# EAGLE design lcd-breakoutboard (EAGLE 6.2)
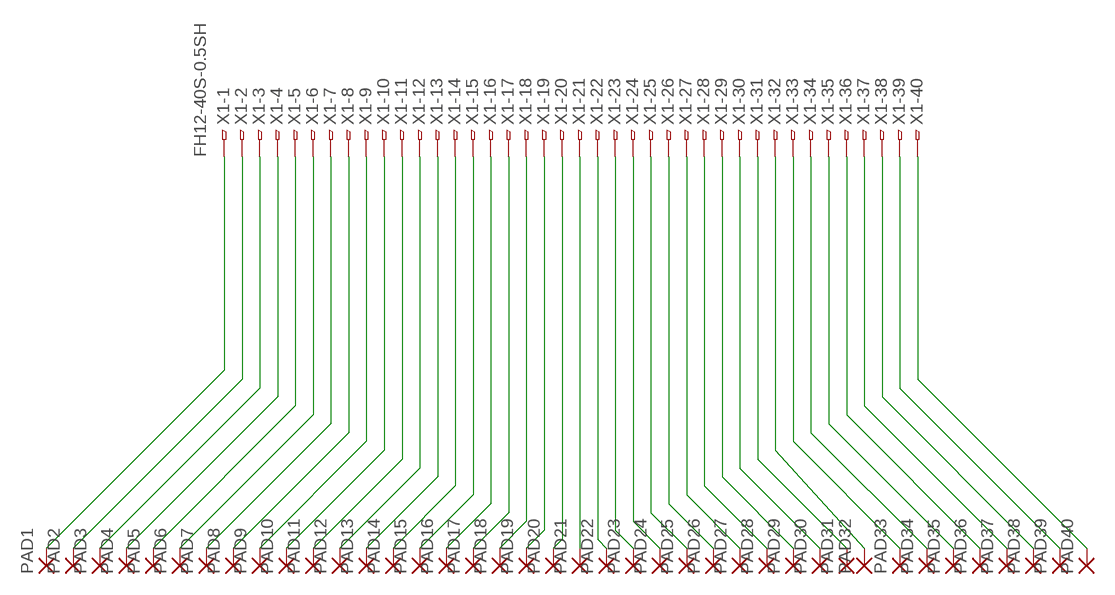
[diagram p0: schematic, sheet 1]

## Parts
PAD1  2,15/1,0  [2,15/1,0]
PAD2  2,15/1,0  [2,15/1,0]
PAD3  2,15/1,0  [2,15/1,0]
PAD4  2,15/1,0  [2,15/1,0]
PAD5  2,15/1,0  [2,15/1,0]
PAD6  2,15/1,0  [2,15/1,0]
PAD7  2,15/1,0  [2,15/1,0]
PAD8  2,15/1,0  [2,15/1,0]
PAD9  2,15/1,0  [2,15/1,0]
PAD10  2,15/1,0  [2,15/1,0]
PAD11  2,15/1,0  [2,15/1,0]
PAD12  2,15/1,0  [2,15/1,0]
PAD13  2,15/1,0  [2,15/1,0]
PAD14  2,15/1,0  [2,15/1,0]
PAD15  2,15/1,0  [2,15/1,0]
PAD16  2,15/1,0  [2,15/1,0]
PAD17  2,15/1,0  [2,15/1,0]
PAD18  2,15/1,0  [2,15/1,0]
PAD19  2,15/1,0  [2,15/1,0]
PAD20  2,15/1,0  [2,15/1,0]
PAD21  2,15/1,0  [2,15/1,0]
PAD22  2,15/1,0  [2,15/1,0]
PAD23  2,15/1,0  [2,15/1,0]
PAD24  2,15/1,0  [2,15/1,0]
PAD25  2,15/1,0  [2,15/1,0]
PAD26  2,15/1,0  [2,15/1,0]
PAD27  2,15/1,0  [2,15/1,0]
PAD28  2,15/1,0  [2,15/1,0]
PAD29  2,15/1,0  [2,15/1,0]
PAD30  2,15/1,0  [2,15/1,0]
PAD31  2,15/1,0  [2,15/1,0]
PAD32  2,15/1,0  [2,15/1,0]
PAD33  2,15/1,0  [2,15/1,0]
PAD34  2,15/1,0  [2,15/1,0]
PAD35  2,15/1,0  [2,15/1,0]
PAD36  2,15/1,0  [2,15/1,0]
PAD37  2,15/1,0  [2,15/1,0]
PAD38  2,15/1,0  [2,15/1,0]
PAD39  2,15/1,0  [2,15/1,0]
PAD40  2,15/1,0  [2,15/1,0]
X1  FH12-40S-0.5SH  [FH12-40S-0.5SH]

## Nets
N$1: PAD1.1(P) X1.1
N$2: PAD2.1(P) X1.2
N$3: PAD3.1(P) X1.3
N$4: PAD4.1(P) X1.4
N$5: PAD5.1(P) X1.5
N$6: PAD6.1(P) X1.6
N$7: PAD7.1(P) X1.7
N$8: PAD8.1(P) X1.8
N$9: PAD9.1(P) X1.9
N$10: PAD10.1(P) X1.10
N$11: PAD11.1(P) X1.11
N$12: PAD12.1(P) X1.12
N$13: PAD13.1(P) X1.13
N$14: PAD14.1(P) X1.14
N$15: PAD15.1(P) X1.15
N$16: PAD16.1(P) X1.16
N$17: PAD17.1(P) X1.17
N$18: PAD18.1(P) X1.18
N$19: PAD19.1(P) X1.19
N$20: PAD20.1(P) X1.20
N$21: PAD21.1(P) X1.21
N$22: PAD22.1(P) X1.22
N$23: PAD23.1(P) X1.23
N$24: PAD24.1(P) X1.24
N$25: PAD25.1(P) X1.25
N$26: PAD26.1(P) X1.26
N$27: PAD27.1(P) X1.27
N$28: PAD28.1(P) X1.28
N$29: PAD29.1(P) X1.29
N$30: PAD30.1(P) X1.30
N$31: PAD31.1(P) X1.31
N$32: PAD32.1(P) X1.32
N$33: PAD33.1(P) X1.33
N$34: PAD34.1(P) X1.34
N$35: PAD35.1(P) X1.35
N$36: PAD36.1(P) X1.36
N$37: PAD37.1(P) X1.37
N$38: PAD38.1(P) X1.38
N$39: PAD39.1(P) X1.39
N$40: PAD40.1(P) X1.40

## Library data of the parts
PAD1-PAD40 = wirepad:2,15/1,0: THROUGH-HOLE PAD
X1 = con-hirose:FH12-40S-0.5S: 0.5mm Pitch Connectors For FPC/FFC Source: Data sheet <http://www.hirose.co.jp/cataloge_hp/e58605370.pdf>; MPN: FH12-40S-0.5SH(55); OC_FARNELL: 1324556; OC_NEWARK: 34M6178

## Board
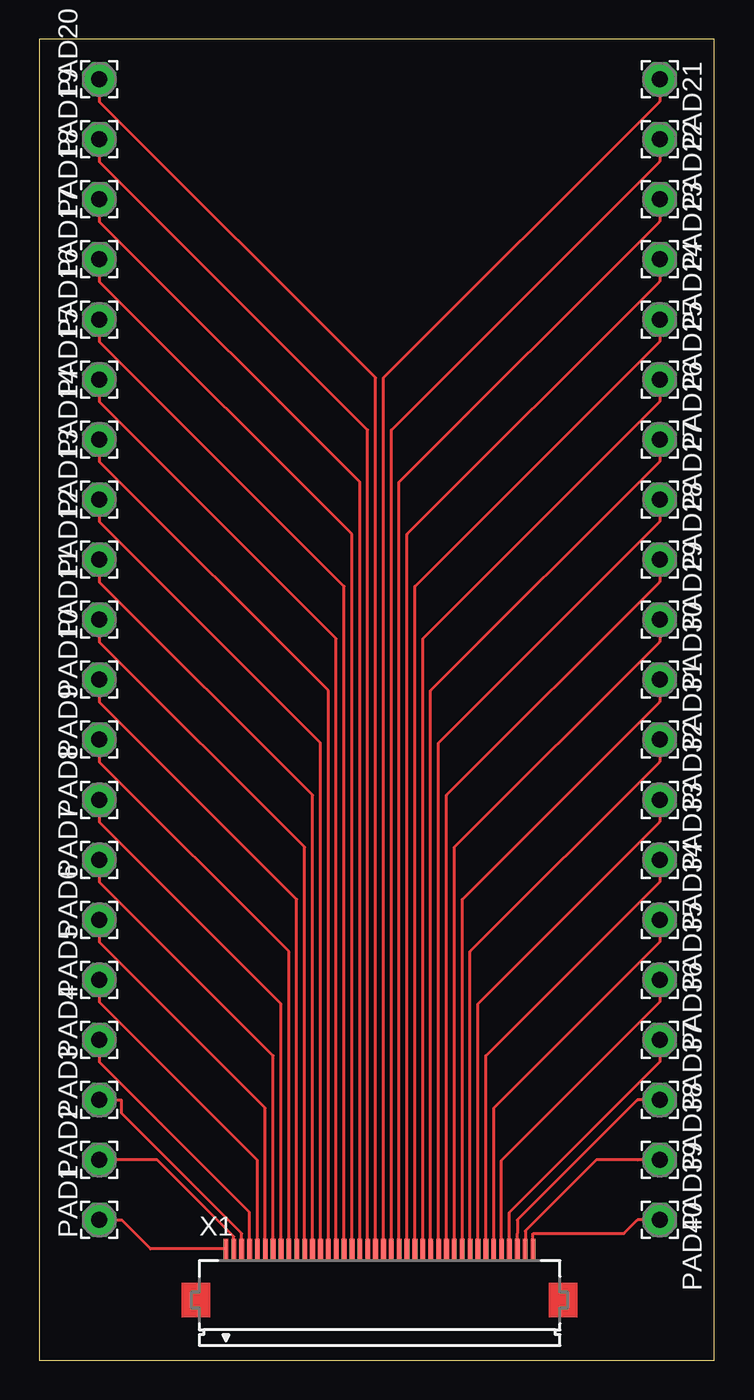
[diagram p1: board, top side]

Size 42.85 x 83.81 mm. Coordinates in mm from the lower left corner, seen from the top.
Outline: 0,0 42.85,0 42.85,83.81 0,83.81 0,0
Copper layers (1*16): Top 0.035mm / dielectric 1.5mm / Bottom 0.035mm
Design rules: minimum track width 8mil, minimum drill 0.3mm, track to track 9mil, track to pad 9mil, pad to pad 9mil, via to via 9mil, smd to smd 9mil, copper to edge 40mil, drill to drill 4mil, minimum pad ring 10mil, minimum via ring 8mil, stop-mask expansion 4mil, vias tented up to drill 0mil, thermal gap 10mil

### Footprints (pad centres in the part's own frame; a part is rotated, then mirrored left to right if it is on the bottom)
2,15/1,0 = drill 1.016 pad 2.159 octagon: 1 0,0
FH12-40S-0.5SH = smd 0.3 x 1.3: 1 -9.75,3.25; 2 -9.25,3.25; 3 -8.75,3.25; 4 -8.25,3.25; 5 -7.75,3.25; 6 -7.25,3.25; 7 -6.75,3.25; 8 -6.25,3.25; 9 -5.75,3.25; 10 -5.25,3.25; 11 -4.75,3.25; 12 -4.25,3.25; 13 -3.75,3.25; 14 -3.25,3.25; 15 -2.75,3.25; 16 -2.25,3.25; 17 -1.75,3.25; 18 -1.25,3.25; 19 -0.75,3.25; 20 -0.25,3.25; 21 0.25,3.25; 22 0.75,3.25; 23 1.25,3.25; 24 1.75,3.25; 25 2.25,3.25; 26 2.75,3.25; 27 3.25,3.25; 28 3.75,3.25; 29 4.25,3.25; 30 4.75,3.25; 31 5.25,3.25; 32 5.75,3.25; 33 6.25,3.25; 34 6.75,3.25; 35 7.25,3.25; 36 7.75,3.25; 37 8.25,3.25; 38 8.75,3.25; 39 9.25,3.25; 40 9.75,3.25

### Placement (x,y rotation side)
PAD1  3.81,8.89 90 top
PAD2  3.81,12.7 90 top
PAD3  3.81,16.51 90 top
PAD4  3.81,20.32 90 top
PAD5  3.81,24.13 90 top
PAD6  3.81,27.94 90 top
PAD7  3.81,31.75 90 top
PAD8  3.81,35.56 90 top
PAD9  3.81,39.37 90 top
PAD10  3.81,43.18 90 top
PAD11  3.81,46.99 90 top
PAD12  3.81,50.8 90 top
PAD13  3.81,54.61 90 top
PAD14  3.81,58.42 90 top
PAD15  3.81,62.23 90 top
PAD16  3.81,66.04 90 top
PAD17  3.81,69.85 90 top
PAD18  3.81,73.66 90 top
PAD19  3.81,77.47 90 top
PAD20  3.81,81.28 90 top
PAD21  39.37,81.28 270 top
PAD22  39.37,77.47 270 top
PAD23  39.37,73.66 270 top
PAD24  39.37,69.85 270 top
PAD25  39.37,66.04 270 top
PAD26  39.37,62.23 270 top
PAD27  39.37,58.42 270 top
PAD28  39.37,54.61 270 top
PAD29  39.37,50.8 270 top
PAD30  39.37,46.99 270 top
PAD31  39.37,43.18 270 top
PAD32  39.37,39.37 270 top
PAD33  39.37,35.56 270 top
PAD34  39.37,31.75 270 top
PAD35  39.37,27.94 270 top
PAD36  39.37,24.13 270 top
PAD37  39.37,20.32 270 top
PAD38  39.37,16.51 270 top
PAD39  39.37,12.7 270 top
PAD40  39.37,8.89 270 top
X1  21.59,3.81 0 top

### Tracks (layer width: path | path; a pad name or v marks a point on that pad's centre or on a via)
N$1
  Top 0.203: PAD1.1 5.22,8.89 7.05,7.06 X1.1
N$2
  Top 0.203: X1.2 12.34,7.85 7.49,12.7 PAD2.1
N$3
  Top 0.203: PAD3.1 5.22,16.51 5.22,15.66 12.84,8.04 X1.3
N$4
  Top 0.203: PAD4.1 3.81,18.91 13.34,9.38 X1.4
N$5
  Top 0.203: PAD5.1 3.81,22.72 13.84,12.69 X1.5
N$6
  Top 0.203: PAD6.1 3.81,26.53 14.34,16 X1.6
N$7
  Top 0.203: PAD7.1 3.81,30.34 14.84,19.31 X1.7
N$8
  Top 0.203: PAD8.1 3.81,34.15 15.34,22.62 X1.8
N$9
  Top 0.203: PAD9.1 3.81,37.96 15.84,25.93 X1.9
N$10
  Top 0.203: PAD10.1 3.81,41.77 16.34,29.24 X1.10
N$11
  Top 0.203: PAD11.1 3.81,45.58 16.84,32.55 X1.11
N$12
  Top 0.203: PAD12.1 3.81,49.39 17.34,35.86 X1.12
N$13
  Top 0.203: PAD13.1 3.81,53.2 17.84,39.17 X1.13
N$14
  Top 0.203: PAD14.1 3.81,57.01 18.34,42.48 X1.14
N$15
  Top 0.203: PAD15.1 3.81,60.82 18.84,45.79 X1.15
N$16
  Top 0.203: PAD16.1 3.81,64.63 19.34,49.1 X1.16
N$17
  Top 0.203: PAD17.1 3.81,68.44 19.84,52.41 X1.17
N$18
  Top 0.203: PAD18.1 3.81,72.25 20.34,55.72 X1.18
N$19
  Top 0.203: PAD19.1 3.81,76.06 20.84,59.03 X1.19
N$20
  Top 0.203: PAD20.1 3.81,79.87 21.34,62.34 X1.20
N$21
  Top 0.203: PAD21.1 39.37,79.87 21.84,62.34 X1.21
N$22
  Top 0.203: PAD22.1 39.37,76.06 22.34,59.03 X1.22
N$23
  Top 0.203: PAD23.1 39.37,72.25 22.84,55.72 X1.23
N$24
  Top 0.203: PAD24.1 39.37,68.44 23.34,52.41 X1.24
N$25
  Top 0.203: PAD25.1 39.37,64.63 23.84,49.1 X1.25
N$26
  Top 0.203: PAD26.1 39.37,60.82 24.34,45.79 X1.26
N$27
  Top 0.203: PAD27.1 39.37,57.01 24.84,42.48 X1.27
N$28
  Top 0.203: PAD28.1 39.37,53.2 25.34,39.17 X1.28
N$29
  Top 0.203: PAD29.1 39.37,49.39 25.84,35.86 X1.29
N$30
  Top 0.203: PAD30.1 39.37,45.58 26.34,32.55 X1.30
N$31
  Top 0.203: PAD31.1 39.37,41.77 26.84,29.24 X1.31
N$32
  Top 0.203: PAD32.1 39.37,37.96 27.34,25.93 X1.32
N$33
  Top 0.203: PAD33.1 39.37,34.15 27.84,22.62 X1.33
N$34
  Top 0.203: PAD34.1 39.37,30.34 28.34,19.31 X1.34
N$35
  Top 0.203: PAD35.1 39.37,26.53 28.84,16 X1.35
N$36
  Top 0.203: PAD36.1 39.37,22.72 29.34,12.69 X1.36
N$37
  Top 0.203: PAD37.1 39.37,18.91 29.84,9.38 X1.37
N$38
  Top 0.203: PAD38.1 37.96,16.51 30.34,8.89 30.34,8.04 X1.38
N$39
  Top 0.203: PAD39.1 37.96,12.7 35.34,12.7 30.84,8.2 X1.39
N$40
  Top 0.203: PAD40.1 37.96,8.89 37.11,8.04 31.34,8.04 X1.40